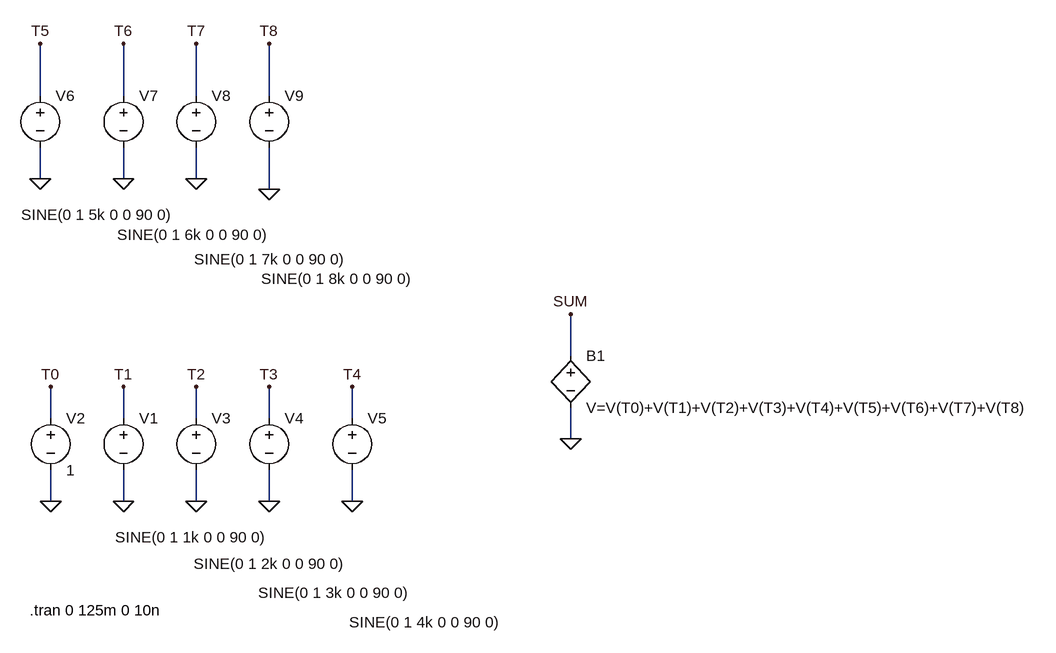
[diagram p0: schematic dirac_impulsefolge.asc]
dirac_impulsefolge.asc, the LTspice schematic file:
Version 4
SHEET 1 1624 680
WIRE -128 -272 -128 -352
WIRE 0 -272 0 -352
WIRE 112 -272 112 -352
WIRE 224 -272 224 -352
WIRE -128 -144 -128 -192
WIRE 0 -144 0 -192
WIRE 112 -144 112 -192
WIRE 224 -128 224 -192
WIRE 688 128 688 64
WIRE -112 224 -112 176
WIRE 0 224 0 176
WIRE 112 224 112 176
WIRE 224 224 224 176
WIRE 352 224 352 176
WIRE 688 256 688 208
WIRE -112 352 -112 304
WIRE 0 352 0 304
WIRE 112 352 112 304
WIRE 224 352 224 304
WIRE 352 352 352 304
FLAG 0 352 0
FLAG -112 352 0
FLAG -112 176 T0
FLAG 0 176 T1
FLAG 112 352 0
FLAG 112 176 T2
FLAG 224 352 0
FLAG 224 176 T3
FLAG 352 352 0
FLAG 352 176 T4
FLAG 688 256 0
FLAG 688 64 SUM
FLAG -128 -144 0
FLAG -128 -352 T5
FLAG 0 -144 0
FLAG 0 -352 T6
FLAG 112 -144 0
FLAG 112 -352 T7
FLAG 224 -128 0
FLAG 224 -352 T8
SYMBOL voltage 0 208 R0
WINDOW 3 -13 199 Left 2
WINDOW 123 0 0 Left 2
WINDOW 39 0 0 Left 2
SYMATTR Value SINE(0 1 1k 0 0 90 0)
SYMATTR InstName V1
SYMBOL voltage -112 208 R0
WINDOW 123 0 0 Left 2
WINDOW 39 0 0 Left 2
SYMATTR InstName V2
SYMATTR Value 1
SYMBOL voltage 112 208 R0
WINDOW 3 -4 240 Left 2
WINDOW 123 0 0 Left 2
WINDOW 39 0 0 Left 2
SYMATTR Value SINE(0 1 2k 0 0 90 0)
SYMATTR InstName V3
SYMBOL voltage 224 208 R0
WINDOW 3 -17 285 Left 2
WINDOW 123 0 0 Left 2
WINDOW 39 0 0 Left 2
SYMATTR Value SINE(0 1 3k 0 0 90 0)
SYMATTR InstName V4
SYMBOL voltage 352 208 R0
WINDOW 3 -5 330 Left 2
WINDOW 123 0 0 Left 2
WINDOW 39 0 0 Left 2
SYMATTR Value SINE(0 1 4k 0 0 90 0)
SYMATTR InstName V5
SYMBOL bv 688 112 R0
SYMATTR InstName B1
SYMATTR Value V=V(T0)+V(T1)+V(T2)+V(T3)+V(T4)+V(T5)+V(T6)+V(T7)+V(T8)
SYMBOL voltage -128 -288 R0
WINDOW 3 -29 199 Left 2
WINDOW 123 0 0 Left 2
WINDOW 39 0 0 Left 2
SYMATTR Value SINE(0 1 5k 0 0 90 0)
SYMATTR InstName V6
SYMBOL voltage 0 -288 R0
WINDOW 3 -10 230 Left 2
WINDOW 123 0 0 Left 2
WINDOW 39 0 0 Left 2
SYMATTR Value SINE(0 1 6k 0 0 90 0)
SYMATTR InstName V7
SYMBOL voltage 112 -288 R0
WINDOW 3 -3 268 Left 2
WINDOW 123 0 0 Left 2
WINDOW 39 0 0 Left 2
SYMATTR Value SINE(0 1 7k 0 0 90 0)
SYMATTR InstName V8
SYMBOL voltage 224 -288 R0
WINDOW 3 -12 298 Left 2
WINDOW 123 0 0 Left 2
WINDOW 39 0 0 Left 2
SYMATTR Value SINE(0 1 8k 0 0 90 0)
SYMATTR InstName V9
TEXT -144 520 Left 2 !.tran 0 125m 0 10n

The netlist it stands for:
* dirac_impulsefolge.asc
V1 T1 0 SINE(0 1 1k 0 0 90 0)
V2 T0 0 1
V3 T2 0 SINE(0 1 2k 0 0 90 0)
V4 T3 0 SINE(0 1 3k 0 0 90 0)
V5 T4 0 SINE(0 1 4k 0 0 90 0)
B1 SUM 0 V=V(T0)+V(T1)+V(T2)+V(T3)+V(T4)+V(T5)+V(T6)+V(T7)+V(T8)
V6 T5 0 SINE(0 1 5k 0 0 90 0)
V7 T6 0 SINE(0 1 6k 0 0 90 0)
V8 T7 0 SINE(0 1 7k 0 0 90 0)
V9 T8 0 SINE(0 1 8k 0 0 90 0)
.tran 0 125m 0 10n
.backanno
.end